# EAGLE schematic ecu2 (EAGLE 9.0.0)
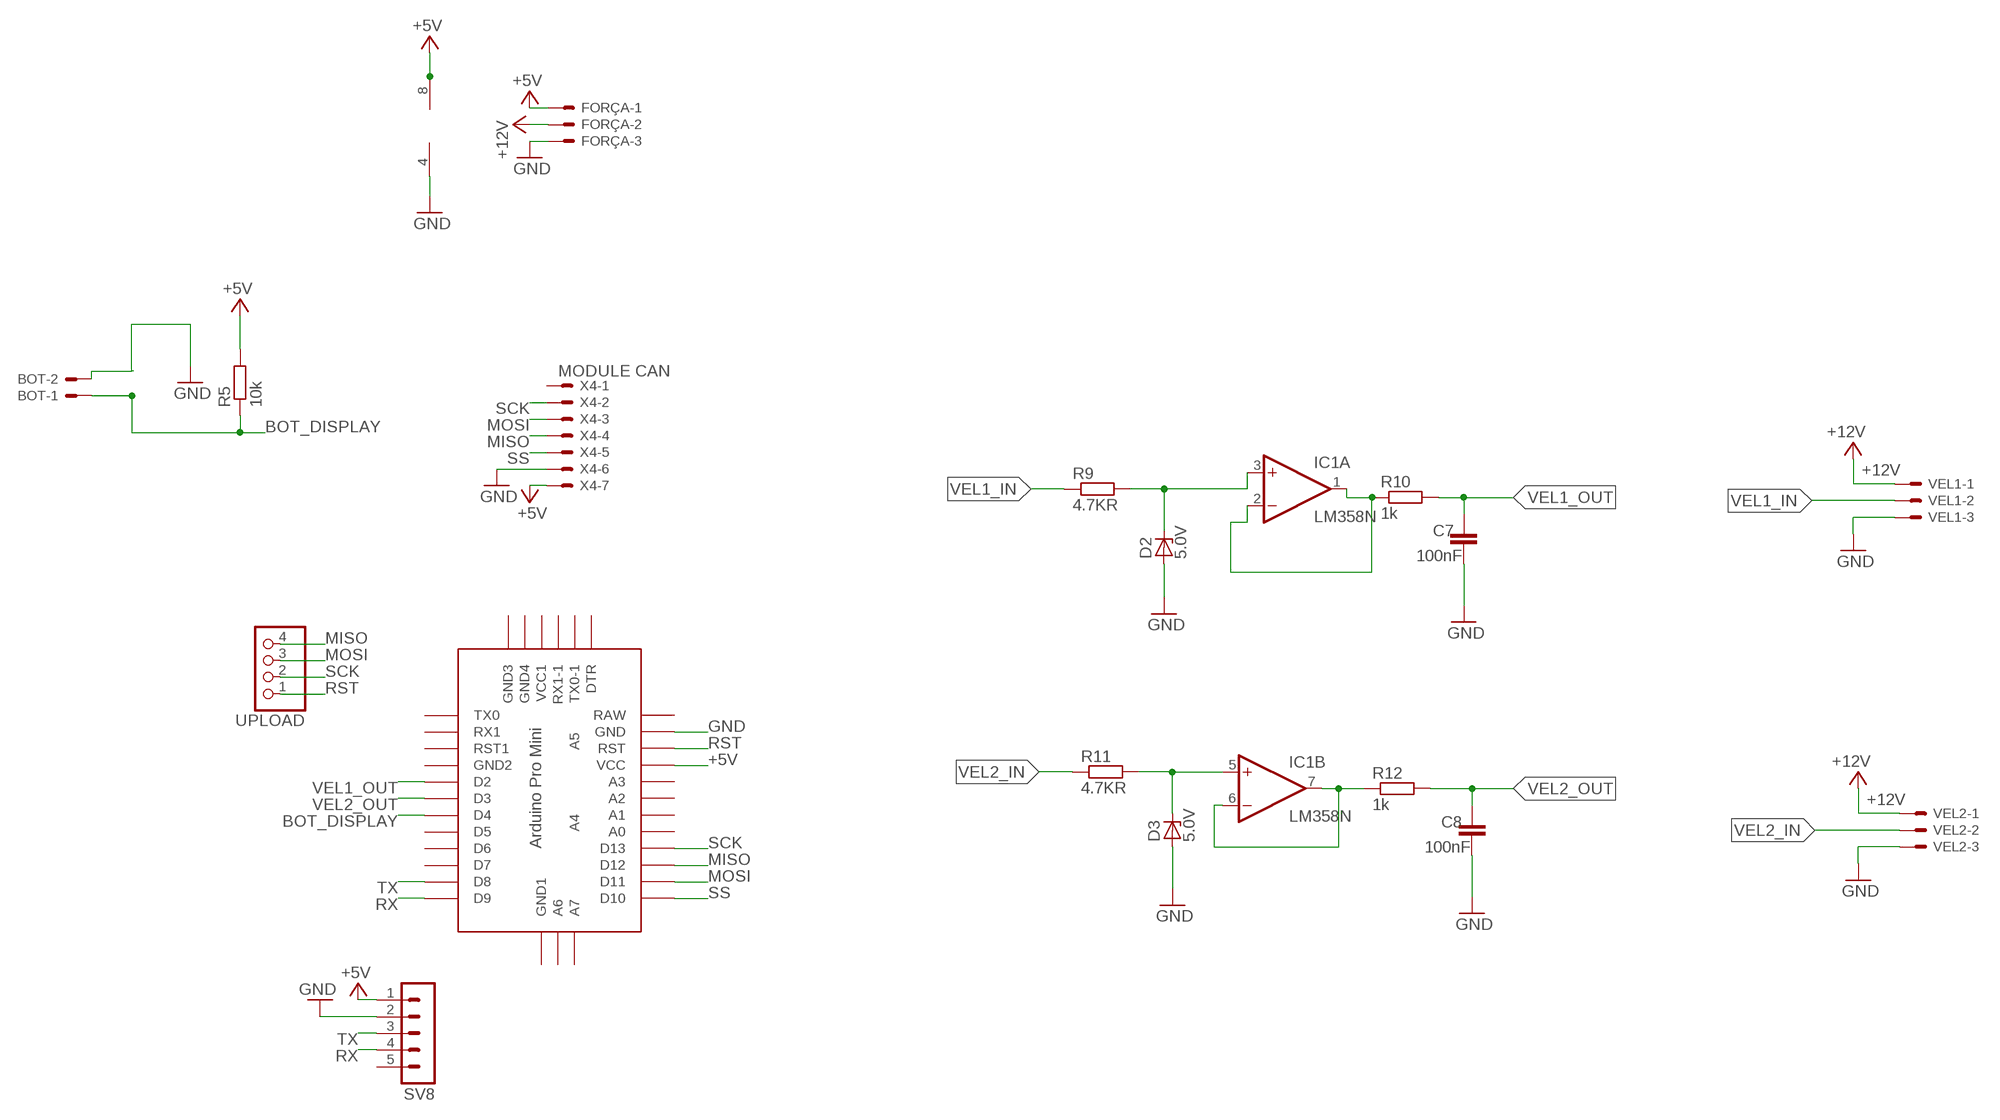
[diagram p0: schematic, sheet 1]

## Parts
BOT  RPM  22-23-2021  [22-23-2021]
C7  100nF  C5/2.5  [C5B2.5]
C8  100nF  C5/2.5  [C5B2.5]
D2  5.0V  ZENER-DIODEDO34-7  [DO34Z7]
D3  5.0V  ZENER-DIODEDO34-7  [DO34Z7]
FORÇA  FORÇA  22-23-2031  [22-23-2031]
IC1  LM358N  [DIL08]
R5  10k  R-EU_0207/7  [0207/7]
R9  4.7KR  R-EU_0207/7  [0207/7]
R10  1k  R-EU_0207/7  [0207/7]
R11  4.7KR  R-EU_0207/7  [0207/7]
R12  1k  R-EU_0207/7  [0207/7]
SV8  MA05-1  [MA05-1]
U$1  ABK-PRO-MINI  [ABK-PRO-MINI]
UPLOAD  PINHD-1X4  [1X04]
VEL1  COMB 1  22-23-2031  [22-23-2031]
VEL2  COMB 2  22-23-2031  [22-23-2031]
X4  MODULE CAN  22-23-2071  [22-23-2071]

## Nets
+5V [ALIMENTACAO]: FORÇA.1 IC1.8(P:V+) R5.2 SV8.1 U$1.VCC X4.7
+12V [ALIMENTACAO]: FORÇA.2 VEL1.1 VEL2.1
BOT_DISPLAY: BOT.1 R5.1 U$1.D4
GND [ALIMENTACAO]: BOT.2 C7.1 C8.1 D2.A D3.A FORÇA.3 IC1.4(P:V-) SV8.2 U$1.GND VEL1.3 VEL2.3 X4.6
MISO: U$1.D12 UPLOAD.4 X4.4
MOSI: U$1.D11 UPLOAD.3 X4.3
N$5: D2.C IC1.3(A:+IN) R9.2
N$12: IC1.1(A:OUT) IC1.2(A:-IN) R10.1
N$13: D3.C IC1.5(B:+IN) R11.2
N$14: IC1.6(B:-IN) IC1.7(B:OUT) R12.1
RST: U$1.RST UPLOAD.1
RX: SV8.4 U$1.D9
SCK: U$1.D13 UPLOAD.2 X4.2
SS: U$1.D10 X4.5
TX: SV8.3 U$1.D8
VEL1_IN [ALIMENTACAO]: R9.1 VEL1.2
VEL1_OUT: C7.2 R10.2 U$1.D2
VEL2_IN [ALIMENTACAO]: R11.1 VEL2.2
VEL2_OUT: C8.2 R12.2 U$1.D3
Unconnected: SV8.5 U$1.A0 U$1.A1 U$1.A2 U$1.A3 U$1.A4 U$1.A5 U$1.A6 U$1.A7 U$1.D5 U$1.D6 U$1.D7 U$1.DTR U$1.GND1(GND2) U$1.GND2(GND3) U$1.GND3(GND4) U$1.GND4(GND1) U$1.RAW U$1.RST1 U$1.RX1 U$1.RX1-1 U$1.TX0 U$1.TX0-1 U$1.VCC1 X4.1

## Library data of the parts
BOT = con-molex:22-23-2021: .100" (2.54mm) Center Header - 2 Pin; MF: MOLEX; MPN: 22-23-2021; OC_FARNELL: 1462926; OC_NEWARK: 25C3832
C7 C8 = capacitor-wima:C: CAPACITOR naming: grid - package width
D2 D3 = diode:ZENER-DIODE: Z-Diode
FORÇA VEL1 VEL2 = con-molex:22-23-2031: .100" (2.54mm) Center Header - 3 Pin; MF: MOLEX; MPN: 22-23-2031; OC_FARNELL: 1462950; OC_NEWARK: 30C0862
IC1 = linear:LM358: OP AMP also LM158; LM258; LM2904 Source: http://cache.national.com/ds/LM/LM158.pdf
R5 R9-R12 = resistor:R-EU_: RESISTOR, European symbol
SV8 = con-lstb:MA05-1: PIN HEADER; OC_FARNELL: unknown; OC_NEWARK: unknown
U$1 = Arduino-clone:ABK-PRO-MINI: ABK Pro-Mini Arduino Clone
UPLOAD = pinhead:PINHD-1X4: PIN HEADER
X4 = con-molex:22-23-2071: .100" (2.54mm) Center Header - 7 Pin; MF: MOLEX; MPN: 22-23-2071; OC_FARNELL: 1654534; OC_NEWARK: 56H0445

## Net classes
1 ALIMENTACAO: width 0.635 mm